# EAGLE design two_Analog_sensors_revA (EAGLE 8.5.0)
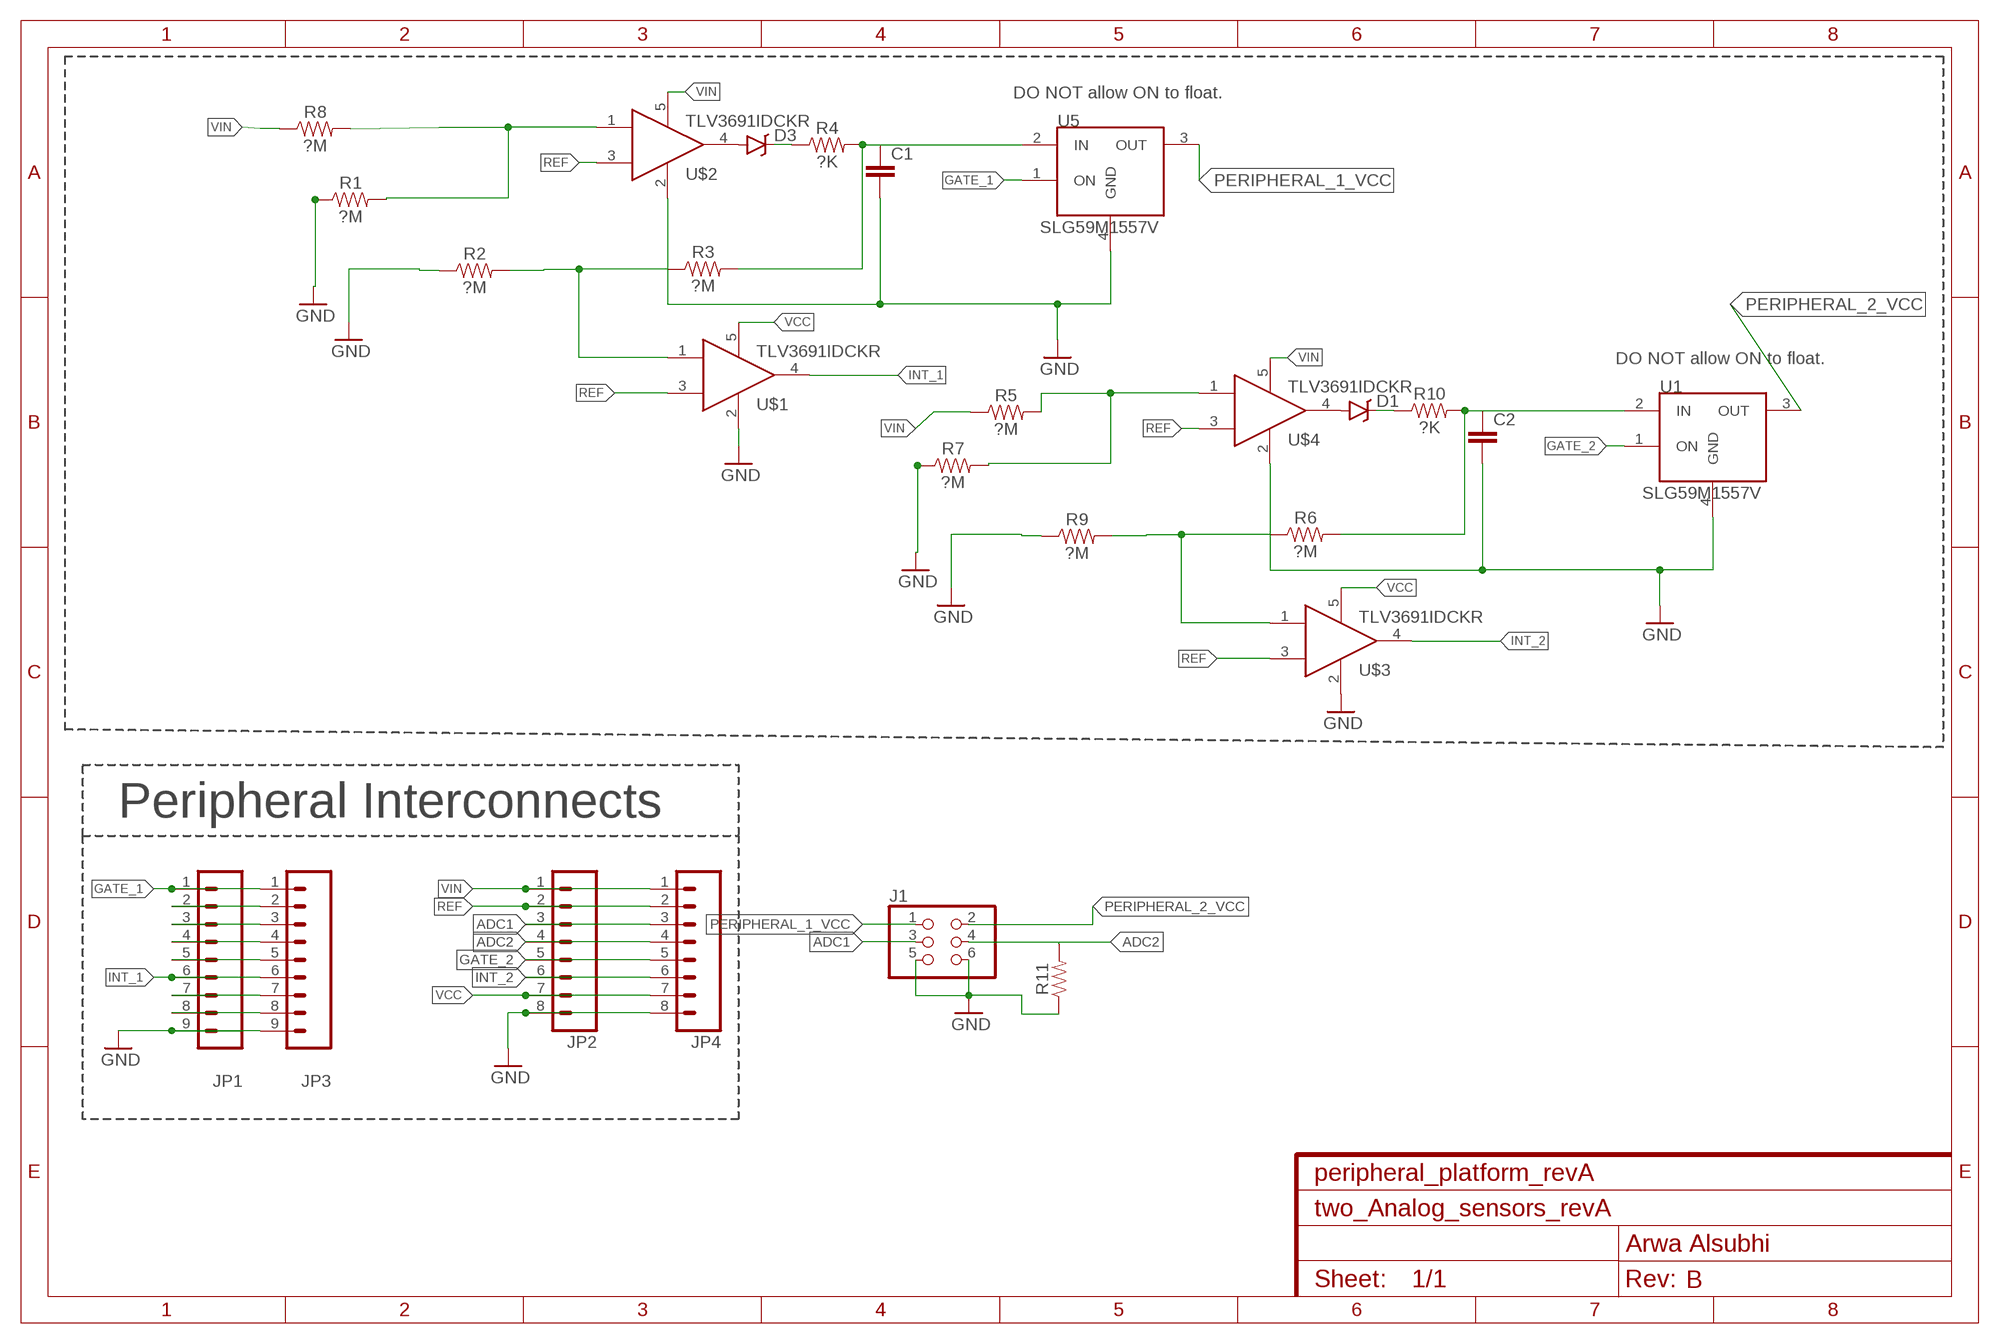
[diagram p0: schematic, sheet 1]
FRAME2 (FRAME-A4L): CNAME: peripheral_platform_revA; CREVISION: B; DESIGNER: Arwa Alsubhi

## Parts
C1  CAP0603-CAP  [0603-CAP]
C2  CAP0603-CAP  [0603-CAP]
D1  RB751  DIODE-SCHOTTKY-RB751  [SOD-523]
D3  RB751  DIODE-SCHOTTKY-RB751  [SOD-523]
J1  PINHD-2X3  [2X03]
JP1  M091.27MM  [1X09-1.27MM]
JP2  M081.27MM  [1X08-1.27MM]
JP3  M091.27MM  [1X09-1.27MM]
JP4  M081.27MM  [1X08-1.27MM]
R1  ?M  0.3OHM-0805-1/8W-1%  [0805]
R2  ?M  0.3OHM-0805-1/8W-1%  [0805]
R3  ?M  0.3OHM-0805-1/8W-1%  [0805]
R4  ?K  0.3OHM-0805-1/8W-1%  [0805]
R5  ?M  0.3OHM-0805-1/8W-1%  [0805]
R6  ?M  0.3OHM-0805-1/8W-1%  [0805]
R7  ?M  0.3OHM-0805-1/8W-1%  [0805]
R8  ?M  0.3OHM-0805-1/8W-1%  [0805]
R9  ?M  0.3OHM-0805-1/8W-1%  [0805]
R10  ?K  0.3OHM-0805-1/8W-1%  [0805]
R11  0.3OHM-0805-1/8W-1%  [0805]
U1  SLG59M1557V  [4STDFN]
U5  SLG59M1557V  [4STDFN]
U$1  TLV3691IDCKR  [SOT353]
U$2  TLV3691IDCKR  [SOT353]
U$3  TLV3691IDCKR  [SOT353]
U$4  TLV3691IDCKR  [SOT353]

## Nets
ADC1: J1.3 JP2.3 JP4.3
ADC2: J1.4 JP2.4 JP4.4 R11.2
GATE_1: JP1.1 JP3.1 U5.1(ON)
GATE_2: JP2.5 JP4.5 U1.1(ON)
GND: C1.2 C2.2 J1.5 J1.6 JP1.9 JP2.8 JP3.9 JP4.8 R1.1 R2.1 R7.1 R9.1 R11.1 U1.4(GND) U5.4(GND) U$1.2 U$2.2 U$3.2 U$4.2
INT_1: JP1.6 JP3.6 U$1.4
INT_2: JP2.6 JP4.6 U$3.4
N$1: D3.A U$2.4
N$2: JP1.4 JP3.4
N$3: JP1.2 JP3.2
N$4: R1.2 R8.2 U$2.1
N$5: R2.2 R3.1 U$1.1
N$6: JP1.5 JP3.5
N$7: JP1.7 JP3.7
N$8: JP1.8 JP3.8
N$10: R5.2 R7.2 U$4.1
N$13: JP1.3 JP3.3
N$14: R6.1 R9.2 U$3.1
N$15: D3.C R4.1
N$16: D1.A U$4.4
N$17: D1.C R10.1
N$18: C2.1 R6.2 R10.2 U1.2(IN)
N$20: C1.1 R3.2 R4.2 U5.2(IN)
PERIPHERAL_1_VCC: J1.1 U5.3(OUT)
PERIPHERAL_2_VCC: J1.2 U1.3(OUT)
REF: JP2.2 JP4.2 U$1.3 U$2.3 U$3.3 U$4.3
VCC: JP2.7 JP4.7 U$1.5 U$3.5
VIN: JP2.1 JP4.1 R5.1 R8.1 U$2.5 U$4.5

## Notes on the sheet
- DO NOT allow ON to float.
- DO NOT allow ON to float.
- Peripheral Interconnects

## Library data of the parts
C1 C2 = SparkFun-Capacitors:CAP: Capacitor Standard 0603 ceramic capacitor, and 0.1" leaded capacitor.
D1 D3 = SparkFun-DiscreteSemi:DIODE-SCHOTTKY: Schottky diodes in SFE's production catalog BAT20J 1A 23V 0.62Vf RB751 120mA 40V 0.37Vf PMEG4005EJ 0.5A 40V 0.42Vf MBRA140 1A 40V 0.5Vf B340A 3A 40V SMA; DIGIKEY: BAS40-02V-V-G-08GICT-ND; MPN: BAS40-02V-V-G-08; PROD_ID: DIO-11018
J1 = SparkFun-Retired:PINHD-2X3: PIN HEADER
JP1 JP3 = SparkFun-Connectors:M09: Header 9 Standard 9-pin 0.1" header. Use with straight break away headers (SKU : PRT-00116), right angle break away headers (PRT-00553), swiss pins (PRT-00743), machine pins (PRT-00117), and female headers (PRT-00115).; DIGIKEY: S9014E-09-ND; MANUFACTURERPARTNUMBER: GRPB091VWVN-RC; MPN: GRPB091VWVN-RC
JP2 JP4 = SparkFun-Connectors:M08: Header 8 Standard 8-pin 0.1" header. Use with straight break away headers (SKU : PRT-00116), right angle break away headers (PRT-00553), swiss pins (PRT-00743), machine pins (PRT-00117), and female headers (PRT-00115).; DIGIKEY: S9014E-08-ND; MANUFACTURERPARTNUMBER: GRPB081VWVN-RC; MPN: GRPB081VWVN-RC
R1-R11 = SparkFun-Resistors:0.3OHM: 0.3Ω resistor A resistor is a passive two-terminal electrical component that implements electrical resistance as a circuit element. Resistors act to reduce current flow, and, at the same time, act to lower voltage levels within circuits. - Wikipedia; PROD_ID: RES-11622; VALUE: 0.3
U1 U5 = loadswitches:SLG59M1557V: SILEGO SLG59M1557V: Ultra-small 28.5 mΩ, 1.0 A Integrated Power Switch with Discharge The SLG59M1557V is designed for load switching applications with ultra low quiescent current (20nA), and low turn on voltage (0.85V). The part comes with one 28.5 mΩ 1.0 A rated P-channel MOSFET controlled by a single ON control pin. The product is packaged in an ultra-small 1.0 x 1.0 mm package.; MANAFACTURER: SLG59M1557V; MOUSER: 402-SLG59M1557V; MPN: SLG59M1557V
U$1-U$4 = Arwa_lib:TLV3691IDCKR

## Board
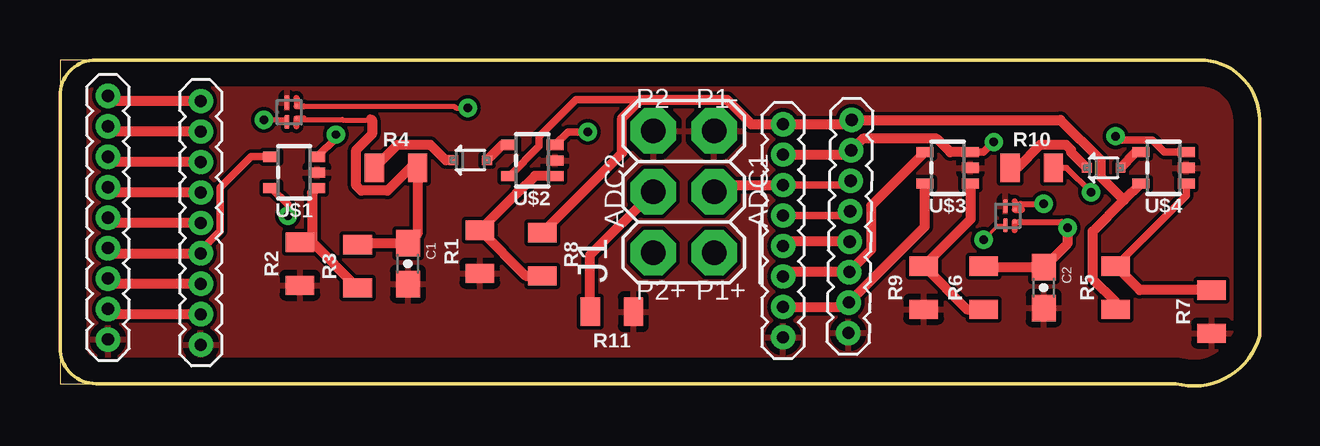
[diagram p1: board, top side]
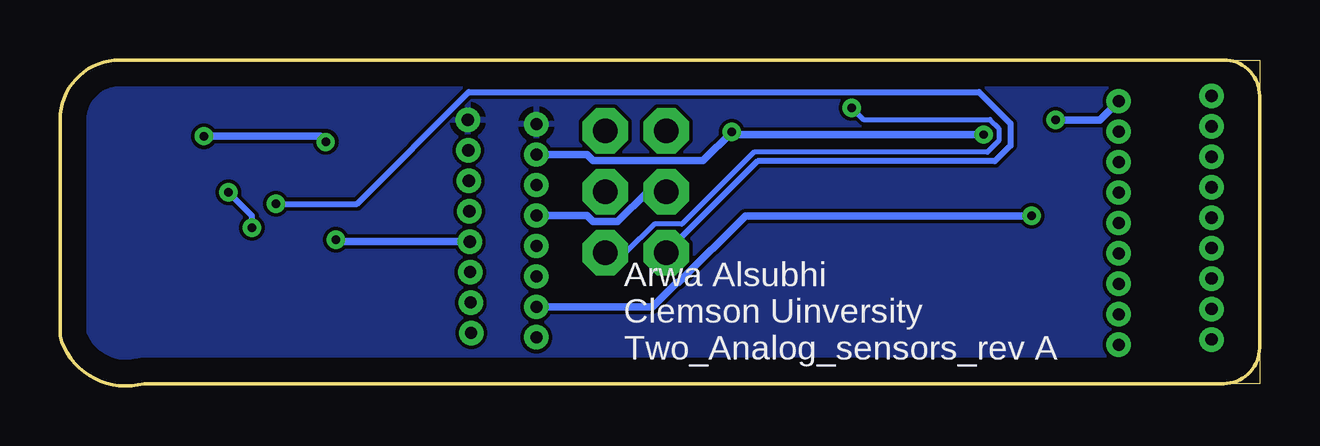
[diagram p2: board, bottom side, seen from below]

Size 50 x 13.6 mm. Coordinates in mm from the lower left corner, seen from the top.
Outline: 1.5,0.1 0,0.1 0,13.6 1.5,13.6
Outline: 1.5,13.6 47.5,13.6 arc-90 50,11.1 50,2.1 arc-90 46.5,0.1 1.5,0.1
Outline: 1.5,13.6 arc90 0,12.1 0,1.6 arc90 1.5,0.1
Copper layers (1*16): Top 0.035mm / dielectric 1.5mm / Bottom 0.035mm
Design rules "default": minimum track width 6mil, minimum drill 0.35mm, track to track 6mil, track to pad 6mil, pad to pad 6mil, via to via 6mil, smd to smd 6mil, copper to edge 40mil, drill to drill 6mil, minimum pad ring 10mil, minimum via ring 8mil, stop-mask expansion 4mil, vias tented up to drill 0mil, thermal gap 10mil

### Footprints (pad centres in the part's own frame; a part is rotated, then mirrored left to right if it is on the bottom)
0603-CAP = smd 1.1 x 1: 1 -0.85,0; 2 0.85,0
SOD-523 = smd 0.4 x 0.4: A -0.7,0; C 0.7,0
2X03 = drill 1.016 pad 1.88 octagon: 1 -2.54,-1.27; 2 -2.54,1.27; 3 0,-1.27; 4 0,1.27; 5 2.54,-1.27; 6 2.54,1.27
1X09-1.27MM = drill 0.508 pad 1: 1 0,0; 2 1.27,0; 3 2.54,0; 4 3.81,0; 5 5.08,0; 6 6.35,0; 7 7.62,0; 8 8.89,0; 9 10.16,0
1X08-1.27MM = drill 0.508 pad 1: 1 0,0; 2 1.27,0; 3 2.54,0; 4 3.81,0; 5 5.08,0; 6 6.35,0; 7 7.62,0; 8 8.89,0
0805 = smd 0.8 x 1.2: 1 -0.9,0; 2 0.9,0
4STDFN = smd 0.6 x 0.2: 1 -0.4,0.1; 4 0.4,0.1 | smd 0.152 x 0.152: 2 -0.25,-0.3; 3 0.25,-0.3
SOT353 = smd 0.42 x 0.7: 1 -0.65,-0.95; 2 0,-0.95; 3 0.65,-0.95; 4 0.65,0.95; 5 -0.65,0.95

### Placement (x,y rotation side)
C1  14.5,5.1 270 top
C2  41,4.1 270 top
D1  43.5,9.1 180 top
D3  17.1,9.42 180 top
J1  26,8.1 90 top
JP1  5.87,11.88 270 top
JP2  30.14,10.92 270 top
JP3  2,12.1 270 top
JP4  33,11.1 269.1 top
R1  17.5,5.6 90 top
R2  10,5.1 90 top
R3  12.41,4.99 90 top
R4  14,9.1 0 top
R5  44,4.1 90 top
R6  38.5,4.1 90 top
R7  48,3.1 90 top
R8  20.1,5.49 270 top
R9  36,4.1 90 top
R10  40.5,9.1 0 top
R11  23,3.1 180 top
U1  39.5,7.1 90 top
U5  9.56,11.42 90 top
U$1  9.76,8.91 90 top
U$2  19.68,9.41 90 top
U$3  37,9.1 90 top
U$4  46,9.1 90 top

### Tracks (layer width: path | path; a pad name or v marks a point on that pad's centre or on a via)
ADC1
  Top 0.305: JP2.3 30.5,8.38 32.78,8.38 JP4.3
  Top 0.406: J1.3 27.55,8.38 30.5,8.38
ADC2
  Top 0.305: JP2.4 32.76,7.11 JP4.4
  Top 0.406: R11.2 22.1,5.47 J1.4
  Bottom 0.305: J1.4 25.51,8.1 26.75,6.86 27.79,6.86 28.04,7.11 JP2.4
GATE_1  (via drill 0.35)
  Top 0.203: U5.1 9.38,11.1 v8.5,11.1
  Top 0.406: JP3.1 2.22,11.88 JP1.1
  Bottom 0.305: v8.5,11.1 6.65,11.1 JP1.1
GATE_2  (via drill 0.35)
  Top 0.152: U1.1 39.1,6.7 v38.5,6.1
  Top 0.406: JP4.5 30.32,6.02 JP2.5
  Bottom 0.305: v38.5,6.1 38.42,6.02 JP4.5
GND
  pour Top: 1,13.6 47.5,13.6 arc-90 50,11.1 50,2.1 arc-90 47.5,0.1 1,0.1 arc-90 0,1.1 0,12.6 arc-90
INT_1
  Top 0.305: U$1.4 7.96,9.56 6.68,8.28 6.68,6.46 5.87,5.65 JP1.6
  Top 0.406: JP3.6 2.22,5.53 JP1.6
INT_2
  Top 0.406: JP2.6 30.32,4.75 JP4.6 32.9,4.77 33.81,5.68 33.81,7.51 U$3.4
N$1
  Top 0.406: D3.A 18.44,10.06 U$2.4
N$2
  Top 0.406: JP1.4 2.22,8.07 JP3.4
N$3
  Top 0.406: JP1.2 2.22,10.61 JP3.2
N$4
  Top 0.406: U$2.1 19.79,8.76 19.08,8.05 19.05,8.05 R1.2 19.41,4.59 R8.2
N$5
  Top 0.406: R2.2 10.5,6 | 10.5,6 R3.1 | U$1.1 10.5,8.05 10.5,6
N$6
  Top 0.406: JP1.5 2.22,6.8 JP3.5
N$7
  Top 0.406: JP1.7 2.22,4.26 JP3.7
N$8
  Top 0.406: JP1.8 2.22,2.99 JP3.8
N$10
  Top 0.305: R5.2 46.95,7.95 U$4.1
  Top 0.406: R7.2 45,4 R5.2
N$13
  Top 0.406: JP1.3 2.22,9.34 JP3.3
N$14
  Top 0.406: U$3.1 37.95,6.95 R9.2 37.8,3.2 R6.1
N$15
  Top 0.406: D3.C 16.08,9.42 15.45,10.06 14.06,10.06 R4.1
N$16
  Top 0.406: D1.A 44.85,9.75 U$4.4
N$17
  Top 0.406: D1.C 42.16,9.74 42.16,9.85 41.95,10.06 40.85,10.06 39.9,9.1 R10.1
N$18  (via drill 0.35)
  Top 0.254: U1.2 41.75,6.85 v42,6.6 | v42.98,8.08 41.96,9.1 R10.2
  Top 0.406: R6.2 38.55,4.95 C2.1 42,5.95 v42,6.6
  Bottom 0.254: v42,6.6 42,7.1 v42.98,8.08
N$20
  Top 0.203: 13,11.1 11.78,11.1 11.76,11.12 9.91,11.12 U5.2
  Top 0.305: 12.93,11.17 13,11.1
  Top 0.406: R3.2 12.47,5.95 C1.1 14.9,6.35 R4.2 14.6,9.1 13.65,8.14 12.55,8.14 12.34,8.35 12.34,9.85 13,10.5 13,11.1
PERIPHERAL_1_VCC  (via drill 0.35)
  Top 0.203: U5.3 16.43,11.67 16.5,11.6 v17,11.6
  Bottom 0.203: J1.1 26.42,5.56 25.22,6.75 24.07,6.75 21.08,9.75 11.34,9.75 10.87,10.23 10.87,10.75 11.24,11.12 16.52,11.12 v17,11.6
PERIPHERAL_2_VCC  (via drill 0.35)
  Top 0.254: U1.3 40.05,7.6 v41,7.6
  Bottom 0.254: v41,7.6 37.62,7.6 32.96,12.26 11.69,12.26 10.38,10.95 10.38,10.03 11.04,9.37 20.92,9.37 J1.2
REF  (via drill 0.35)
  Top 0.305: U$1.3 11.5,10.35 v11.5,10.49 | v22,10.6 21.17,10.6 U$2.3 | U$4.3 46.04,9.75 45.53,10.27 44.15,10.27 v44,10.42 | v38.92,10.18 38.5,9.75 U$3.3
  Top 0.406: JP2.2 32.8,9.65 JP4.2 33.47,10.32 36.55,10.32 37.11,9.75 U$3.3
  Bottom 0.305: v11.5,10.49 21.89,10.49 v22,10.6 23.2,9.4 27.79,9.4 28.04,9.65 JP2.2 | v44,10.42 39.17,10.42 v38.92,10.18
VCC  (via drill 0.35)
  Top 0.305: U$1.5 9.5,7.57 v9.5,7.1
  Top 0.406: JP2.7 32.7,3.3 JP4.7 36.05,6.65 U$3.5
  Bottom 0.305: v9.5,7.1 21.43,7.1 24.21,4.32 24.29,4.32 25.3,3.3 JP2.7
VIN
  Top 0.305: U$2.5 19.98,10.01 19.98,10.4 21.51,11.94 24.5,11.94
  Top 0.406: R8.1 23.43,9.73 23.43,11.18 24.19,11.94 24.5,11.94 27.81,11.94 28.82,10.92 JP2.1 32.82,10.92 JP4.1 41.7,11.1 43.36,9.44 43.36,8.74 44.35,7.75 | R5.1 44,3.5 43.04,4.45 43.04,6.44 44.35,7.75 | 44.35,7.75 U$4.5
  pour Bottom: 2,13.6 47.5,13.6 arc-90 50,11.1 50,2.6 arc-90 47.5,0.1 2.5,0.1 arc-90 0,2.6 0,12.1 arc-90

### Text on the board
tNames: P2- | P1- | ADC2 | ADC1 | P2+ | P1+
bNames: Arwa Alsubhi / Clemson Uinversity / Two_Analog_sensors_rev A